# Altium project placagps.PrjPcb
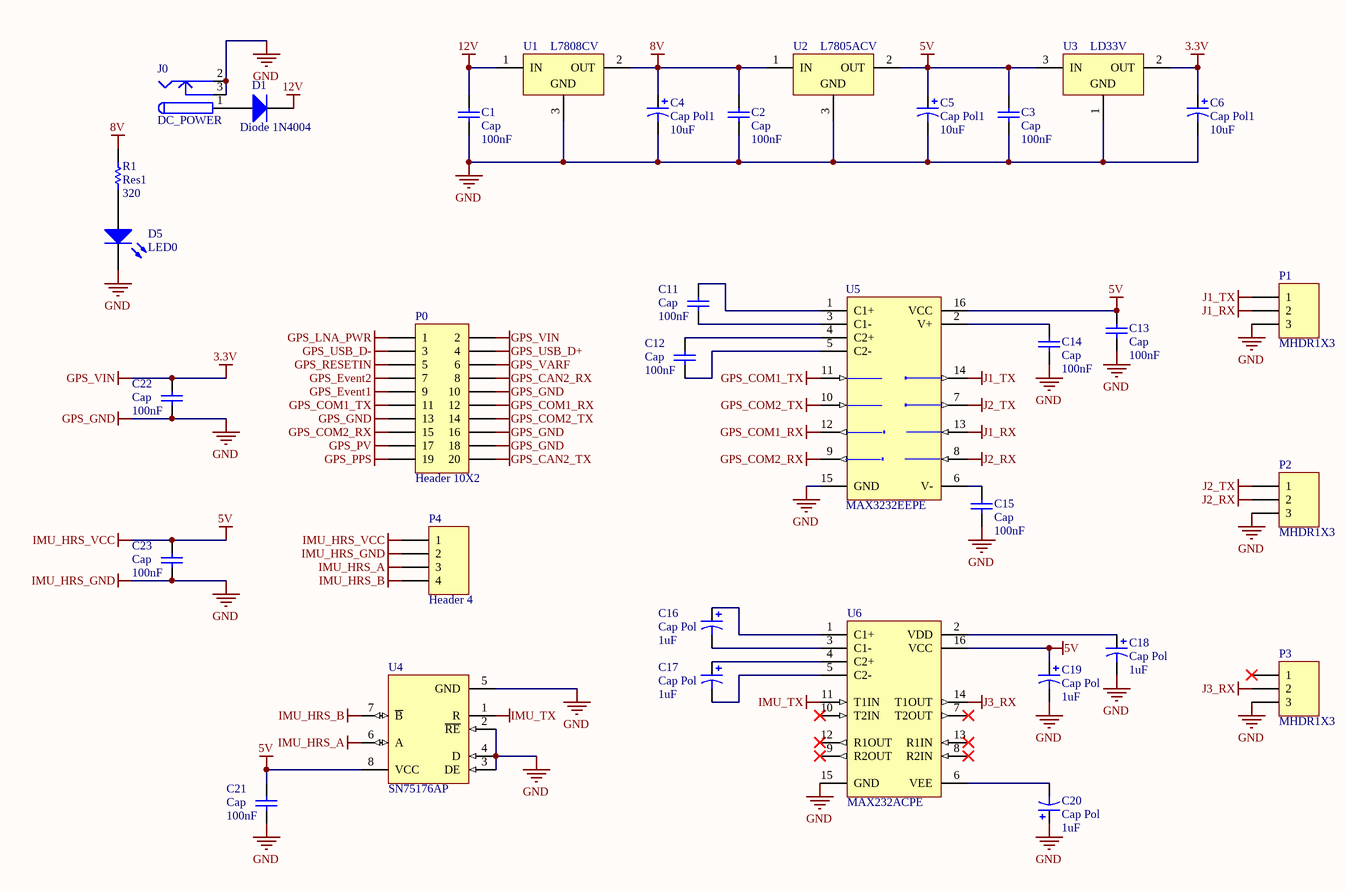
[diagram p0: schematic.SchDoc]
1 sheet, 34 parts. Net scope: global (net labels, ports and power ports of the same name join across sheets).
Board files: board.PcbDoc, panel.PcbDoc

## Sheet schematic.SchDoc: Placa GPS/IMU
size A3; Author: George Andrew Brindeiro; Revision: RevA0; SheetNumber: 1; SheetTotal: 1; Number: v1.0

### Parts
C1  Cap  value 100nF  [VP32-3.2]
C2  Cap  value 100nF  [VP32-3.2]
C3  Cap  value 100nF  [VP32-3.2]
C4  Cap Pol1  value 10uF  [B]
C5  Cap Pol1  value 10uF  [B]
C6  Cap Pol1  value 10uF  [B]
C11  Cap  value 100nF  [VP32-3.2]
C12  Cap  value 100nF  [VP32-3.2]
C13  Cap  value 100nF  [VP32-3.2]
C14  Cap  value 100nF  [VP32-3.2]
C15  Cap  value 100nF  [VP32-3.2]
C16  Cap Pol  value 1uF  [B]
C17  Cap Pol  value 1uF  [B]
C18  Cap Pol  value 1uF  [B]
C19  Cap Pol  value 1uF  [B]
C20  Cap Pol  value 1uF  [B]
C21  Cap  value 100nF  [VP32-3.2]
C22  Cap  value 100nF  [VP32-3.2]
C23  Cap  value 100nF  [VP32-3.2]
D1  Diode 1N4004  [DO-41]
D5  LED0  [B]
J0  DC_POWER  [DC_POWER]
P0  Header 10X2  [HDR2X10]
P1  MHDR1X3  [HDR1X3]
P2  MHDR1X3  [HDR1X3]
P3  MHDR1X3  [HDR1X3]
P4  Header 4  [HDR1X4]
R1  Res1  value 320  [AXIAL-0.3]
U1  L7808CV  [TO220ABN]
U2  L7805ACV  [TO220ABN]
U3  LD33V  [T03B]
U4  SN75176AP  [P008]
U5  MAX3232EEPE  [PE16]
U6  MAX232ACPE  [PE16A]

### Nets
3.3V: C6.1 C22.2 P0.2 U3.2(OUT)  [also labelled GPS_VIN]
5V: C3.1 C5.1 C13.2 C19.1 C21.2 C23.2 P4.1 U2.2(OUT) U3.3(IN) U4.8(VCC) U5.16(VCC) U6.16(VCC)  [also labelled IMU_HRS_VCC]
8V: C2.1 C4.1 R1.2 U1.2(OUT) U2.1(IN)
12V: C1.1 D1.2(K) U1.1(IN)
GND: C1.2 C2.2 C3.2 C4.2 C5.2 C6.2 C13.1 C14.1 C15.1 C18.2 C19.2 C20.1 C21.1 C22.1 C23.1 D5.2(K) J0.2 J0.3 P0.10 P0.13 P0.16 P0.18 P1.3 P2.3 P3.3 P4.2 U1.3(GND) U2.3(GND) U3.1(GND) U4.2(~{RE}) U4.3(DE) U4.4(D) U4.5(GND) U5.15(GND) U6.15(GND)  [also labelled GPS_GND, IMU_HRS_GND]
GPS_CAN2_RX: P0.8
GPS_CAN2_TX: P0.20
GPS_COM1_RX: P0.12 U5.12(R1OUT)
GPS_COM1_TX: P0.11 U5.11(T1IN)
GPS_COM2_RX: P0.15 U5.9(R2OUT)
GPS_COM2_TX: P0.14 U5.10(T2IN)
GPS_Event1: P0.9
GPS_Event2: P0.7
GPS_LNA_PWR: P0.1
GPS_PPS: P0.19
GPS_PV: P0.17
GPS_RESETIN: P0.5
GPS_USB_D+: P0.4
GPS_USB_D-: P0.3
GPS_VARF: P0.6
IMU_HRS_A: P4.3 U4.6(A)
IMU_HRS_B: P4.4 U4.7(~{B})
IMU_TX: U4.1(R) U6.11(T1IN)
J1_RX: P1.2 U5.13(R1IN)
J1_TX: P1.1 U5.14(T1OUT)
J2_RX: P2.2 U5.8(R2IN)
J2_TX: P2.1 U5.7(T2OUT)
J3_RX: P3.2 U6.14(T1OUT)
NetC11_1: C11.1 U5.3(C1-)
NetC11_2: C11.2 U5.1(C1+)
NetC12_1: C12.1 U5.5(C2-)
NetC12_2: C12.2 U5.4(C2+)
NetC14_2: C14.2 U5.2(V+)
NetC15_2: C15.2 U5.6(V-)
NetC16_1: C16.1 U6.1(C1+)
NetC16_2: C16.2 U6.3(C1-)
NetC17_1: C17.1 U6.4(C2+)
NetC17_2: C17.2 U6.5(C2-)
NetC18_1: C18.1 U6.2(VDD)
NetC20_2: C20.2 U6.6(VEE)
NetD1_1: D1.1(A) J0.1
NetD5_1: D5.1(A) R1.1

Not connected (* = marked no-connect by the designer): P3 1*; U6 7(T2OUT)* 8(R2IN)* 9(R2OUT)* 10(T2IN)* 12(R1OUT)* 13(R1IN)*

### Library data of the parts
C1-C3 C11-C15 C21-C23 = Cap: Capacitor; Published: 8-Jun-2000; LatestRevisionDate: 17-Jul-2002; LatestRevisionNote: Re-released for DXP Platform.; PackageReference: RAD-0.3; Publisher: Altium Limited
C4-C6 C16-C20 = Cap Pol1: Polarized Capacitor (Radial); Published: 8-Jun-2000; LatestRevisionDate: 17-Jul-2002; LatestRevisionNote: Re-released for DXP Platform.; PackageReference: RB7.6-15; Publisher: Altium Limited
D1 = Diode 1N4004: 1 Amp General Purpose Rectifier; Published: 8-Jun-2000; LatestRevisionDate: 17-Jul-2002; LatestRevisionNote: Re-released for DXP Platform.; DatasheetDocument: 1998; PackageDocument: Aug-1999; PackageReference: DO-41; Publisher: Altium Limited; Code_JEDEC: DO-204-AL; ComponentLink1Description: Manufacturer Link; ComponentLink1URL: http://www.fairchildsemi.com/; ComponentLink2Description: Datasheet; ComponentLink2URL: http://www.fairchildsemi.com/ds/1N%2F1N4001.pdf
D5 = LED0: Typical INFRARED GaAs LED; Published: 8-Jun-2000; LatestRevisionDate: 08-Jul-2005; LatestRevisionNote: Mech Layer 1 removed.; PackageReference: LED-0; Publisher: Altium Limited
J0 = DC_POWER: Low Voltage Power Supply Connector; Published: 17-Dec-2003; DatasheetDocument: 09-May-2002; Publisher: Altium Limited; ComponentLink1Description: Manufacturer Link; ComponentLink1URL: http://domino.kycon.com/internet/Products.html
P0 = Header 10X2: Header, 10-Pin, Dual row; LatestRevisionDate: 17-Jul-2002; LatestRevisionNote: Re-released for DXP Platform.; Publisher: Altium Limited
P1-P3 = MHDR1X3: Header, 3-Pin; LatestRevisionDate: 17-Jul-2002; LatestRevisionNote: Re-released for DXP Platform.; Publisher: Altium Limited
P4 = Header 4: Header, 4-Pin; LatestRevisionDate: 17-Jul-2002; LatestRevisionNote: Re-released for DXP Platform.; Publisher: Altium Limited
R1 = Res1: Resistor; Published: 8-Jun-2000; LatestRevisionDate: 17-Jul-2002; LatestRevisionNote: Re-released for DXP Platform.; PackageReference: AXIAL-0.3; Publisher: Altium Limited
U1 = L7808CV: Positive Voltage Regulator; Note: Tab is connected to pin 3 (GND).; Published: 24-Aug-2001; LatestRevisionDate: 17-Jul-2002; LatestRevisionNote: Re-released for DXP Platform.; DatasheetVersion: Dec-1998; PackageVersion: Jun-1998; PackageReference: TO220ABN; Publisher: Altium Limited; PackageDescription: TO, Thru-Hole, Vertical, Heatsink Mounted; 3 In-Line Leads; Pitch 2.54 mm; Pin sequence 1, 3, 2; ComponentLink1Description: Manufacturer Link; ComponentLink1URL: http://www.st.com/
U2 = L7805ACV: Precision 1A Regulator; Note: Tab is connected to pin 3 (GND).; Published: 24-Aug-2001; LatestRevisionDate: 17-Jul-2002; LatestRevisionNote: Re-released for DXP Platform.; DatasheetVersion: Nov-1999; PackageVersion: Jun-1998; PackageReference: TO220ABN; Publisher: Altium Limited; PackageDescription: TO, Thru-Hole, Vertical, Heatsink Mounted; 3 In-Line Leads; Pitch 2.54 mm; Pin sequence 1, 3, 2; ComponentLink1Description: Manufacturer Link; ComponentLink1URL: http://www.st.com/; ComponentLink2Description: Datasheet; ComponentLink2URL: http://www.st.com/stonline/products/literature/ds/2144/l7805ab.pdf
U3 = LM1117T-3.3: 800mA Low-Dropout Linear Regulator; Manufacturer: National Semiconductor; CompType: LDO IC; PackageTopMarking: NSUZXYTTE#*LM1117T*3.3; Published: 4-Dec-2008; DatasheetVersion: Apr-2006; PackageVersion: revL, Jan-1992; PackageReference: T03B; Publisher: Altium Limited; PackageDescription: TO-220, Molded, 3 Lead, Straight; PartNumber: LM1117T-3.3; RoHS: O; PinCount: 3; DigiKeyPartNumber: LM1117T-3.3-ND; ComponentLink1Description: LM1117 Datasheet; ComponentLink1URL: http://www.national.com/ds/LM/LM1117.pdf; ComponentLink2Description: LM1117 Web Page; ComponentLink2URL: http://www.national.com/pf/LM/LM1117.html; ComponentLink3Description: T03B Package Page; ComponentLink3URL: http://www.national.com/packaging/folders/t03b.html
U4 = SN75176AP: Differential Bus Transceiver; Note: Receiver Hysteresis of 50mV Typical; Published: 15-May-2002; LatestRevisionDate: 04-Mar-2005; LatestRevisionNote: Stylized 3D Model Added.; DatasheetVersion: Aug-1989; PackageVersion: Jun-1999; PackageReference: P008; Publisher: Altium Limited; PackageDescription: DIP; 8 Leads; Row Spacing 7.62 mm; Pitch 2.54 mm; Code_JEDEC: MO-001-AN; ComponentLink1Description: Manufacturer Link; ComponentLink1URL: http://www.ti.com/; ComponentLink2Description: Datasheet; ComponentLink2URL: http://www-s.ti.com/sc/ds/sn75176a.pdf
U5 = MAX3232EEPE: ±15kV ESD-Protected, 3.0V to 5.5V, Low-Power, up to 250kbps, True RS-232 Transceiver; Published: 16-Jan-2001; LatestRevisionDate: 06-Jun-2005; LatestRevisionNote: Stylized 3D Model Added.; DatasheetVersion: Mar-1999; PackageVersion: Aug-2000; PackageReference: PE16; Publisher: Altium Limited; PackageDescription: DIP; 16 Leads; Row Spacing 7.62 mm; Pitch 2.54 mm; Code_JEDEC: MS-001-BB; ComponentLink1Description: Manufacturer Link; ComponentLink1URL: http://www.maxim-ic.com/; ComponentLink2Description: Datasheet; ComponentLink2URL: http://pdfserv.maxim-ic.com/en/ds/MAX3222E-MAX3246E.pdf
U6 = MAX232ACPE: +5V Powered, Multi-Channel RS-232 Driver/Receiver; Published: 16-Jan-2001; LatestRevisionDate: 06-Jun-2005; LatestRevisionNote: Stylized 3D Model Added.; PackageVersion: 1997; PackageReference: PE16A; Publisher: Altium Limited; PackageDescription: DIP; 16 Leads; Row Spacing 7.62 mm; Pitch 2.54 mm; Code_JEDEC: MS-001-BB; ComponentLink1Description: Manufacturer Link; ComponentLink1URL: http://www.maxim-ic.com/; ComponentLink2Description: Datasheet; ComponentLink2URL: http://pdfserv.maxim-ic.com/en/ds/MAX220-MAX249.pdf